# EAGLE design Fonte1 (EAGLE 9.6.2)
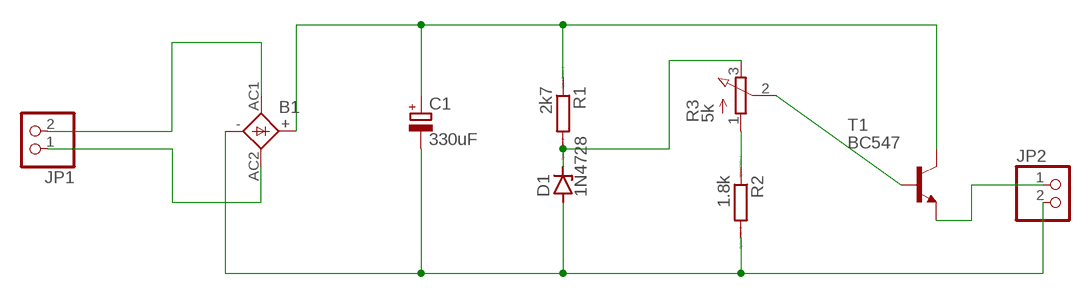
[diagram p0: schematic, sheet 1]

## Parts
B1  1KAB  [1KAB]
C1  330uF  CPOL-EUE5-10.5  [E5-10,5]
D1  1N4728  [DO41Z10]
JP1  PINHD-1X2  [1X02]
JP2  PINHD-1X2  [1X02]
R1  2k7  R0207/10  [0207/10]
R2  1.8k  R0207/10  [0207/10]
R3  5k  3RP/1610N  [3RP/1610N]
T1  BC547  [TO92]

## Nets
N$1: B1.AC1 JP1.2
N$2: B1.AC2 JP1.1
N$3: B1.+ C1.+ R1.1 T1.3(C)
N$4: D1.C R1.2 R3.3(E)
N$5: B1.- C1.- D1.A JP2.2 R2.2
N$6: JP2.1 T1.1(E)
N$7: R3.2(S) T1.2(B)
N$8: R2.1 R3.1(A)

## Library data of the parts
B1 = rectifier:1KAB: RECTIFIER grid 5,08 x 5,08 mm
C1 = rcl:CPOL-EU: POLARIZED CAPACITOR, European symbol; SPICEPREFIX: C
D1 = diode:1N4728: Z DIODE 3.3 V, 1W, 5 percent
JP1 JP2 = pinhead:PINHD-1X2: PIN HEADER
R1 R2 = eagle-ltspice:R: RESISTOR, European symbol; SPICEMODEL: NONE; SPICEPREFIX: R
R3 = pot:3RP/1610N: 16mm Potentiometer one level Source: http://www.alphapotentiometers.net/html/16mm_pot_2.html
T1 = transistor:BC547: NPN TRANSISTOR

## Board
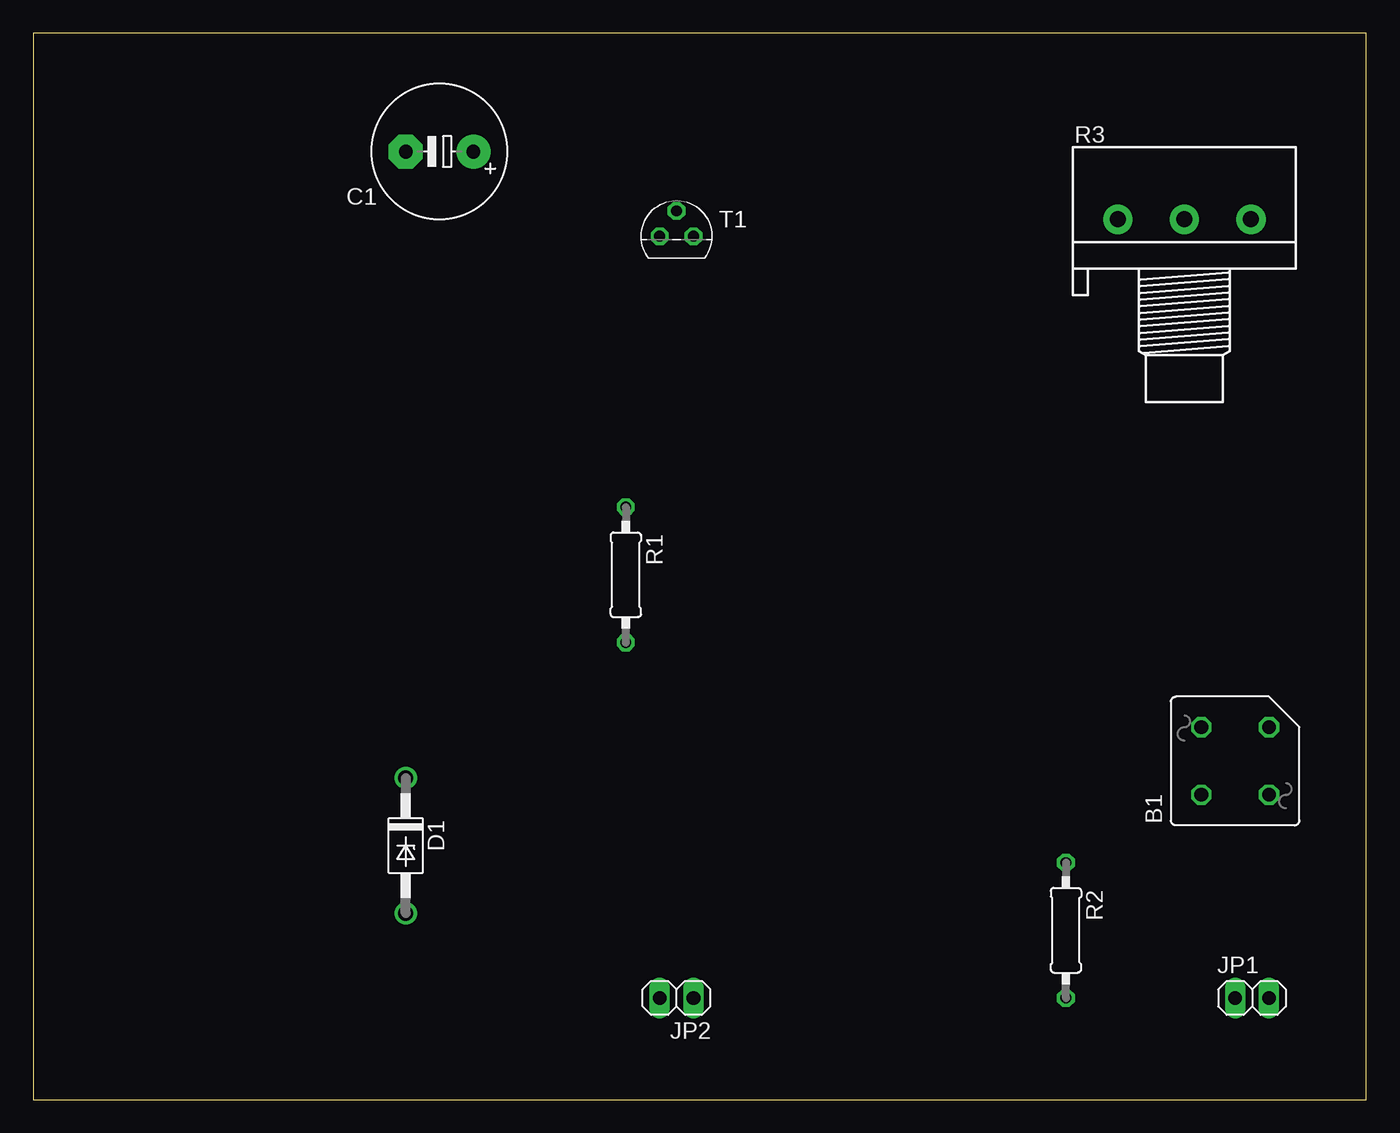
[diagram p1: board, top side]
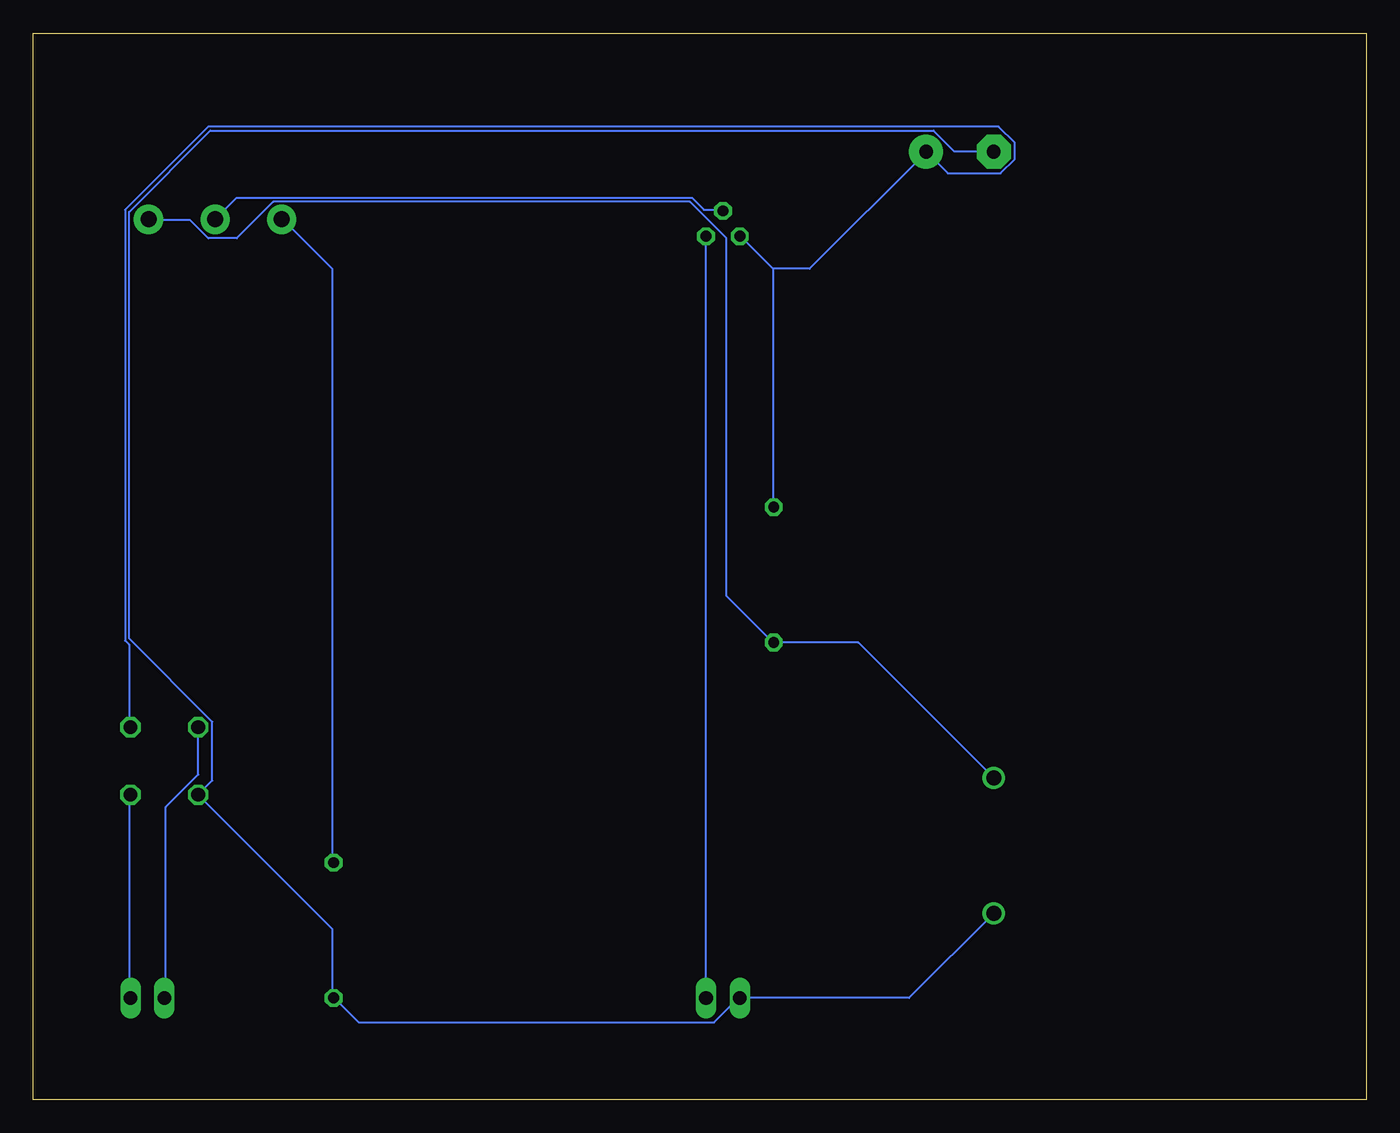
[diagram p2: board, bottom side, seen from below]

Size 100 x 80 mm. Coordinates in mm from the lower left corner, seen from the top.
Outline: 0,0 100,0 100,80 0,80 0,0
Copper layers (1*16): Top 0.035mm / dielectric 1.5mm / Bottom 0.035mm
Design rules "default": minimum track width 6mil, minimum drill 0.35mm, track to track 6mil, track to pad 6mil, pad to pad 6mil, via to via 6mil, smd to smd 6mil, copper to edge 40mil, drill to drill 6mil, minimum pad ring 10mil, minimum via ring 8mil, stop-mask expansion 4mil, vias tented up to drill 0mil, thermal gap 10mil

### Footprints (pad centres in the part's own frame; a part is rotated, then mirrored left to right if it is on the bottom)
1KAB = drill 1.016 octagon: + 2.54,-2.54; - -2.54,2.54; AC1 -2.54,-2.54; AC2 2.54,2.54
E5-10,5 = drill 1.016 pad 2.54: + -2.54,0 | drill 1.016 pad 2.54 octagon: - 2.54,0
DO41Z10 = drill 1.118: A 5.08,0; C -5.08,0
1X02 = drill 1.016 long: 1 -1.27,0; 2 1.27,0
0207/10 = drill 0.813 octagon: 1 -5.08,0; 2 5.08,0
3RP/1610N = drill 1.2 pad 2.184: 1 -5,0; 2 0,0; 3 5,0
TO92 = drill 0.813 octagon: 1 1.27,0; 2 0,1.905; 3 -1.27,0

### Placement (x,y rotation side)
B1  90.17,25.4 90 top
C1  30.48,71.12 180 top
D1  27.94,19.05 270 top
JP1  91.44,7.62 0 top
JP2  48.26,7.62 180 top
R1  1k  [0207/10]  44.45,39.37 270 top
R2  77.47,12.7 270 top
R3  86.36,66.04 0 top
T1  48.26,64.77 0 top

### Tracks (layer width: path | path; a pad name or v marks a point on that pad's centre or on a via)
N$1
  Bottom 0.152: JP1.2 92.81,7.62 92.81,22.86 B1.AC1
N$2
  Bottom 0.152: B1.AC2 87.63,24.38 90.07,21.95 90.07,7.62 JP1.1
N$3
  Bottom 0.152: 44.5,62.33 44.5,44.5 R1.1 | 44.5,62.33 46.94,64.77 T1.3 | B1.+ 92.81,28.04 92.81,34.14 93.12,34.44 93.12,66.75 86.87,73 27.58,73 26.36,71.78 26.36,70.56 27.43,69.49 31.39,69.49 C1.+ 33.07,71.02 41.76,62.33 44.5,62.33
N$4
  Bottom 0.152: D1.C 38.1,34.29 R1.2 44.5,34.29 48.01,37.8 48.01,64.62 50.75,67.36 81.99,67.36 84.73,64.62 86.87,64.62 88.24,65.99 91.29,65.99 R3.3
N$5
  Bottom 0.152: D1.A 34.29,7.62 JP2.2 47.09,7.62 48.92,5.79 75.59,5.79 77.42,7.62 R2.2 77.57,7.62 77.57,12.8 B1.- 86.56,23.93 86.56,28.35 92.81,34.59 92.81,66.6 86.72,72.69 32.46,72.69 30.94,71.17 28.04,71.17 C1.-
N$6
  Bottom 0.152: JP2.1 T1.1
N$7
  Bottom 0.152: R3.2 84.73,67.67 50.6,67.67 49.68,66.75 48.31,66.75 T1.2
N$8
  Bottom 0.152: R2.1 77.57,17.83 77.57,62.33 81.23,65.99 R3.1